# EAGLE schematic data_proV1.1 (EAGLE 7.6.0)
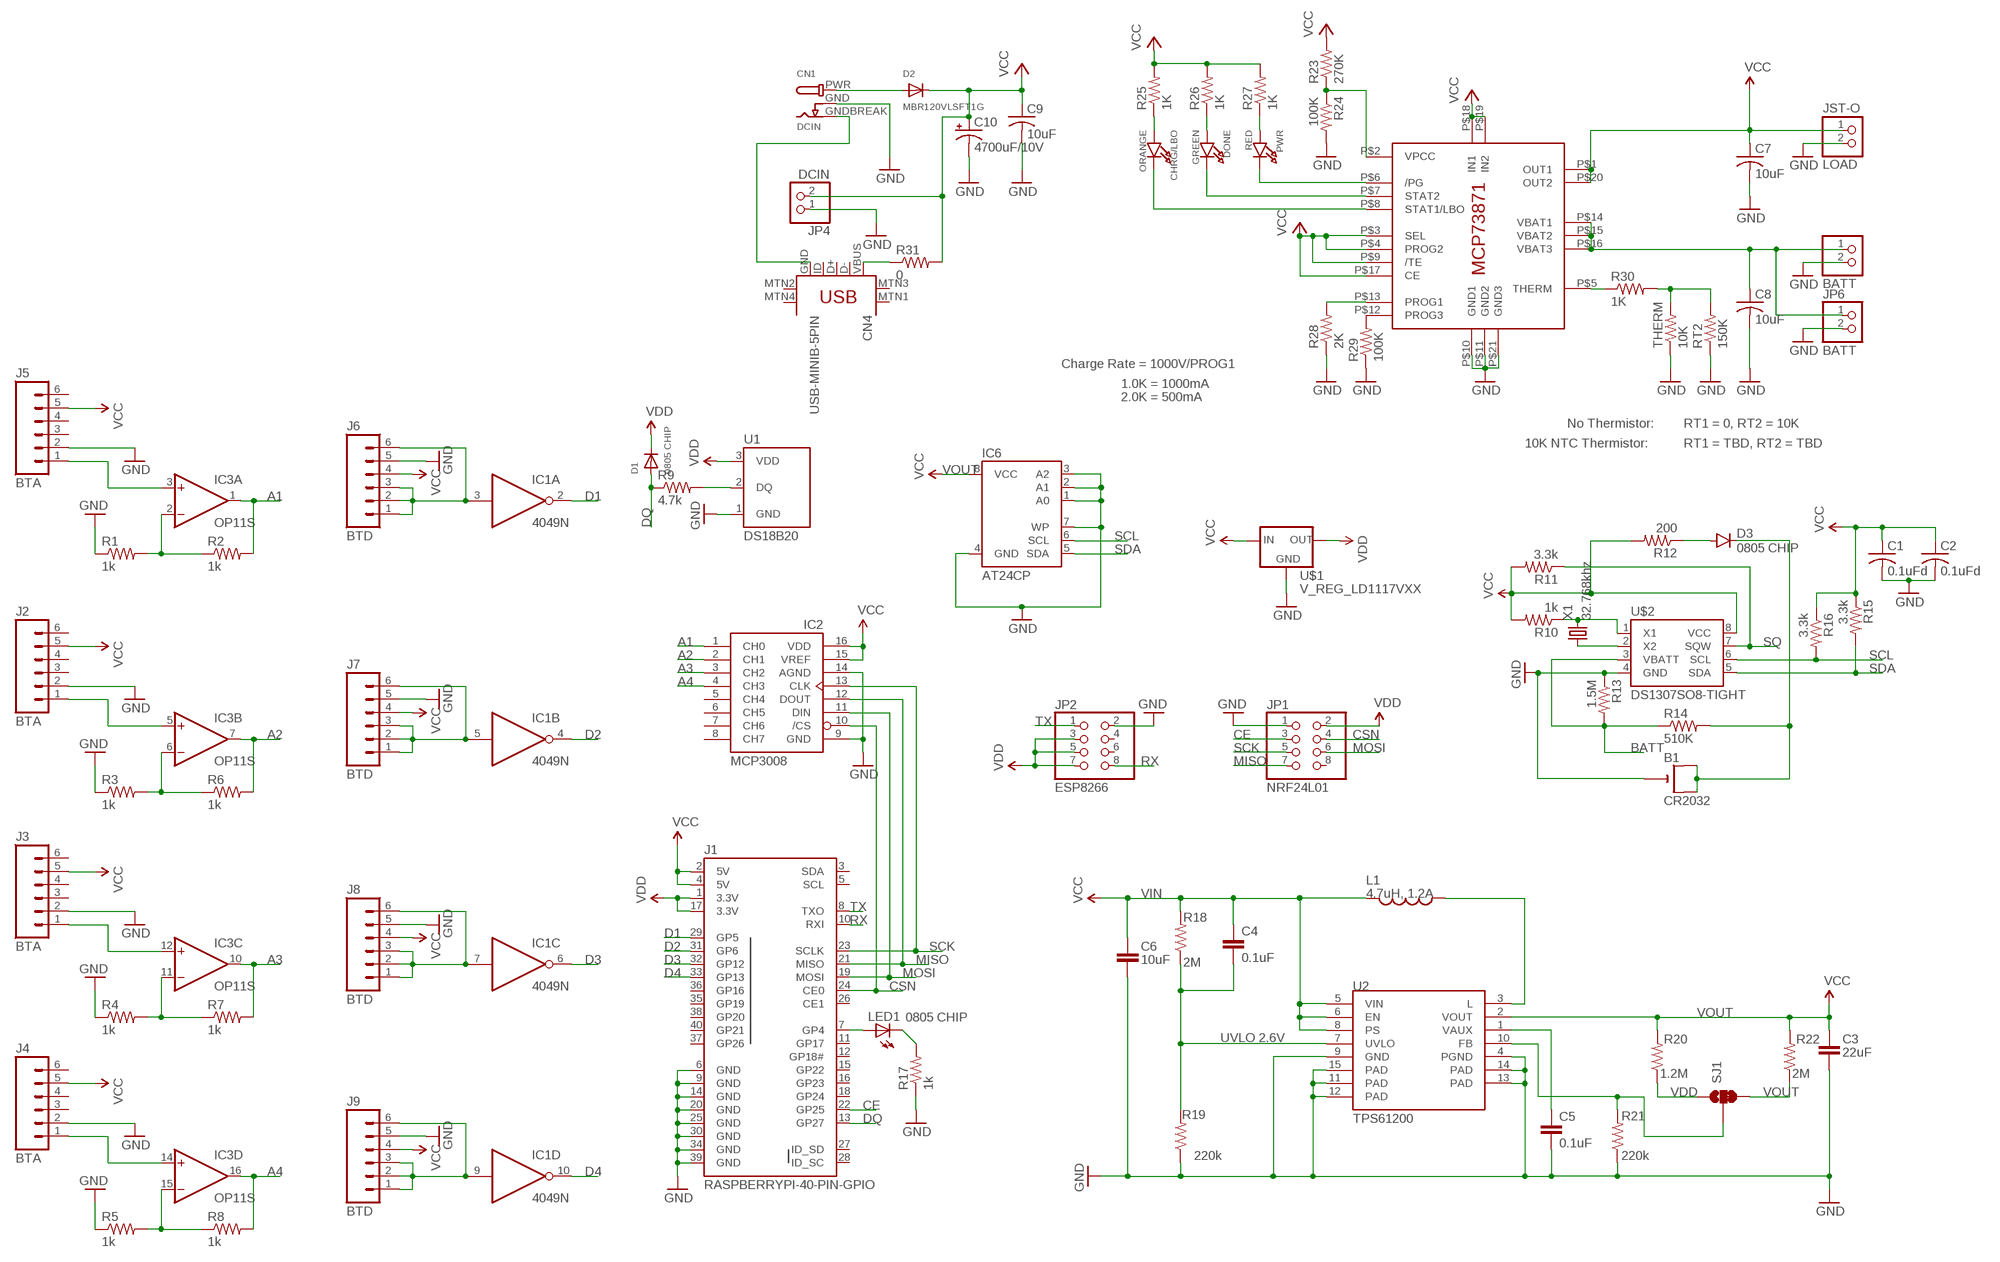
[diagram p0: schematic, sheet 1]

## Parts
B1  CR2032  CR2032SMT  [CR2032-SMD]
BATT  JST_2PIN-SMT-RA  [JST-PH-2-SMT-RA]
C1  0.1uFd  C-USC0805  [C0805]
C2  0.1uFd  C-USC0805  [C0805]
C3  22uF  CAP0805  [0805]
C4  0.1uF  CAP0603-CAP  [0603-CAP]
C5  0.1uF  CAP0603-CAP  [0603-CAP]
C6  10uF  CAP1206  [1206]
C7  10uF  C-USC0805K  [C0805K]
C8  10uF  C-USC0805K  [C0805K]
C9  10uF  C-USC0805K  [C0805K]
C10  4700uF/10V  CPOL-USE5-13  [E5-13]
CHRG/LBO  ORANGE  LED0805_NOOUTLINE  [CHIPLED_0805_NOOUTLINE]
CN1  DCIN  DCBARRELSMT  [DCJACK_2MM_SMT]
CN4  USB-MINIB-5PIN  [USB-MINIB]
D1  0805 CHIP  DIODESOD-323F  [SOD-323F]
D2  MBR120VLSFT1G  DIODESOD-123  [SOD-123]
D3  0805 CHIP  DIODESMB  [SMB-DIODE]
DONE  GREEN  LED0805_NOOUTLINE  [CHIPLED_0805_NOOUTLINE]
IC1  4049N  [DIL16]
IC2  MCP3008  [DIL16]
IC3  OP11S  [DIL16]
IC4  MCP73871  [QFN20_4MM]
IC6  AT24CP  [DIL08]
J1  RASPBERRYPI-40-PIN-GPIO  [2X20-SHROUDED]
J2  BTA  M06VERNIER-ANALOG  [BTA]
J3  BTA  M06VERNIER-ANALOG  [BTA]
J4  BTA  M06VERNIER-ANALOG  [BTA]
J5  BTA  M06VERNIER-ANALOG  [BTA]
J6  BTD  M06VERNIER-DIGITAL  [BTD]
J7  BTD  M06VERNIER-DIGITAL  [BTD]
J8  BTD  M06VERNIER-DIGITAL  [BTD]
J9  BTD  M06VERNIER-DIGITAL  [BTD]
JP1  NRF24L01  PINHD-2X4  [2X04]
JP2  ESP8266  PINHD-2X4  [2X04]
JP4  DCIN  HEADER-1X2  [1X02_OVAL]
JP6  BATT  HEADER-1X2ROUND  [1X02_ROUND]
L1  4.7uH, 1.2A  INDUCTOR.  [CDRH2D09]
LED1  0805 CHIP  LEDCHIP-LED0805  [CHIP-LED0805]
LOAD  JST-O  JST_2PIN-SMT-RA  [JST-PH-2-SMT-RA]
PWR  RED  LED0805_NOOUTLINE  [CHIPLED_0805_NOOUTLINE]
R1  1k  R-US_R0805  [R0805]
R2  1k  R-US_R0805  [R0805]
R3  1k  R-US_R0805  [R0805]
R4  1k  R-US_R0805  [R0805]
R5  1k  R-US_R0805  [R0805]
R6  1k  R-US_R0805  [R0805]
R7  1k  R-US_R0805  [R0805]
R8  1k  R-US_R0805  [R0805]
R9  4.7k  R-US_R0805  [R0805]
R10  1k  R-US_R0805  [R0805]
R11  3.3k  R-US_R0805  [R0805]
R12  200  R-US_R0805  [R0805]
R13  1.5M  R-US_R0805  [R0805]
R14  510K  R-US_R0805  [R0805]
R15  3.3k  R-US_R0805  [R0805]
R16  3.3k  R-US_R0805  [R0805]
R17  1k  R-US_R0805  [R0805]
R18  2M  RESISTOR0603-RES  [0603-RES]
R19  220k  RESISTOR0603-RES  [0603-RES]
R20  1.2M  RESISTOR0603-RES  [0603-RES]
R21  220k  RESISTOR0603-RES  [0603-RES]
R22  2M  RESISTOR0603-RES  [0603-RES]
R23  270K  R-US_R0805  [R0805]
R24  100K  R-US_R0805  [R0805]
R25  1K  R-US_R0805  [R0805]
R26  1K  R-US_R0805  [R0805]
R27  1K  R-US_R0805  [R0805]
R28  2K  R-US_FLIPFLOP  [0805-THM]
R29  100K  R-US_R0805  [R0805]
R30  1K  R-US_M0805  [M0805]
R31  0  R-US_R0805  [R0805]
RT2  150K  R-US_M0805  [M0805]
SJ1  SOLDERJUMPER_2WAYPASTE2&3  [SJ_3_PASTE2&3]
THERM  10K  R-US_FLIPFLOP  [0805-THM]
U1  DS18B20  [TO-92-AMMO]
U2  TPS61200  [QFN-10_PAD]
U$1  V_REG_LD1117VXX  [78XXL]
U$2  DS1307SO8-TIGHT  [SO08-TIGHT]
X1  32.768khz  CRYSTALTC38H  [TC38H]

## Nets
A1: IC2.1(CH0) IC3.1(A:OUT) R2.2
A2: IC2.2(CH1) IC3.7(B:OUT) R6.2
A3: IC2.3(CH2) IC3.10(C:OUT) R7.2
A4: IC2.4(CH3) IC3.16(D:OUT) R8.2
BATT: R13.2 R14.1 U$2.3(VBATT)
BATT1: BATT.1 C8.1 IC4.P$14(VBAT1) IC4.P$15(VBAT2) IC4.P$16(VBAT3) JP6.1
CE: J1.22(GP25) JP1.3
CSN: IC2.10(/CS) J1.24(CE0) JP1.4
D1: IC1.2(A:O) J1.29(GP5)
D2: IC1.4(B:O) J1.31(GP6)
D3: IC1.6(C:O) J1.32(GP12)
D4: IC1.10(D:O) J1.33(GP13)
DQ: D1.A J1.13(GP27) R9.1
FB: R21.2 SJ1.2 U2.10(FB)
GND: B1.- BATT.2 C1.2 C2.2 C3.2 C5.2 C6.2 C7.2 C8.2 C9.2 C10.- CN1.GND(GNDBREAK) IC2.9(GND) IC2.14(AGND) IC4.P$10(GND1) IC4.P$11(GND2) IC4.P$21(GND3) IC6.1(A0) IC6.2(A1) IC6.3(A2) IC6.4(GND) IC6.7(WP) J1.6(GND) J1.9(GND) J1.14(GND) J1.20(GND) J1.25(GND) J1.30(GND) J1.34(GND) J1.39(GND) J2.2 J3.2 J4.2 J5.2 J6.5 J7.5 J8.5 J9.5 JP1.1 JP2.2 JP4.1 JP6.2 LOAD.2 R1.1 R3.1 R4.1 R5.1 R13.1 R17.1 R19.1 R21.1 R24.2 R28.1 R29.1 RT2.1 THERM.1 U1.1(GND) U2.4(PGND) U2.9(GND) U2.11(PAD) U2.12(PAD) U2.13(PAD) U2.14(PAD) U2.15(PAD) U$1.IN(GND) U$2.4(GND)
MISO: IC2.12(DOUT) J1.21(MISO) JP1.7
MOSI: IC2.11(DIN) J1.19(MOSI) JP1.6
N$1: U$2.2(X2) X1.1
N$2: R10.1 U$2.1(X1) X1.2
N$3: B1.+$1(+) B1.+$2(+1) D3.C R14.2
N$4: J1.7(GP4) LED1.A
N$5: IC3.2(A:-IN) R1.2 R2.1
N$6: R9.2 U1.2(DQ)
N$7: IC3.15(D:-IN) R5.2 R8.1
N$8: IC3.6(B:-IN) R3.2 R6.1
N$9: L1.P$1 U2.3(L)
N$10: D3.A R12.1
N$11: IC1.3(A:I) J6.1 J6.2 J6.3 J6.6
N$12: IC1.5(B:I) J7.1 J7.2 J7.3 J7.6
N$13: C5.1 U2.1(VAUX)
N$14: IC1.7(C:I) J8.1 J8.2 J8.3 J8.6
N$15: IC1.9(D:I) J9.1 J9.2 J9.3 J9.6
N$16: IC3.11(C:-IN) R4.2 R7.1
N$17: LED1.C R17.2
N$18: IC4.P$2(VPCC) R23.1 R24.1
N$19: IC4.P$6(/PG) PWR.C
N$20: DONE.C IC4.P$7(STAT2)
N$21: CHRG/LBO.C IC4.P$8(STAT1/LBO)
N$22: CHRG/LBO.A R25.1
N$23: DONE.A R26.1
N$24: PWR.A R27.1
N$25: IC4.P$12(PROG3) R29.2
N$26: IC4.P$13(PROG1) R28.2
N$27: IC4.P$5(THERM) R30.1
N$28: R30.2 RT2.2 THERM.2
N$29: CN1.PWR D2.A
N$30: CN4.VBUS R31.1
N$31: CN1.GNDBREAK(GND) CN4.GND
RX: J1.10(RXI) JP2.8
S1-5V1: IC3.5(B:+IN) J2.1
S1-5V2: IC3.12(C:+IN) J3.1
S1-5V3: IC3.3(A:+IN) J5.1
S1-5V4: IC3.14(D:+IN) J4.1
SCK: IC2.13(CLK) J1.23(SCLK) JP1.5
SCL: IC6.6(SCL) R16.2 U$2.6(SCL)
SDA: IC6.5(SDA) R15.2 U$2.5(SDA)
SQ: R11.1 U$2.7(SQW)
TX: J1.8(TXO) JP2.1
UVLO: C4.2 R18.1 R19.2 U2.7(UVLO)
VDD: D1.C J1.1(3.3V) J1.17(3.3V) JP1.2 JP2.3 JP2.5 JP2.7 R20.1 SJ1.1 U1.3(VDD) U$1.GND(OUT)
VIN: C4.1 C6.1 C7.1 IC4.P$1(OUT1) IC4.P$20(OUT2) L1.P$2 LOAD.1 R18.2 U2.5(VIN) U2.6(EN) U2.8(PS) ; supply symbol labelled VCC
VOUT: C1.1 C2.1 C3.1 C9.1 C10.+ D2.C IC2.15(VREF) IC2.16(VDD) IC4.P$3(SEL) IC4.P$4(PROG2) IC4.P$9(/TE) IC4.P$17(CE) IC4.P$18(IN1) IC4.P$19(IN2) IC6.8(VCC) J1.2(5V) J1.4(5V) J2.5 J3.5 J4.5 J5.5 J6.4 J7.4 J8.4 J9.4 JP4.2 R10.2 R11.2 R12.2 R15.1 R16.1 R20.2 R22.1 R22.2 R23.2 R25.2 R26.2 R27.2 R31.2 SJ1.3 U2.2(VOUT) U$1.OUT(IN) U$2.8(VCC) ; supply symbol labelled VCC
Unconnected: CN4.D+ CN4.D- CN4.ID CN4.MTN1(MTN2) CN4.MTN2(MTN3) CN4.MTN3(MTN1) CN4.MTN4 IC1.11(E:I) IC1.12(E:O) IC1.14(F:I) IC1.15(F:O) IC2.5(CH4) IC2.6(CH5) IC2.7(CH6) IC2.8(CH7) J1.3(SDA) J1.5(SCL) J1.11(GP17) J1.12(GP18#) J1.15(GP22) J1.16(GP23) J1.18(GP24) J1.26(CE1) J1.27(ID_SD) J1.28(ID_SC) J1.35(GP19) J1.36(GP16) J1.37(GP26) J1.38(GP20) J1.40(GP21) J2.3 J2.4 J2.6 J3.3 J3.4 J3.6 J4.3 J4.4 J4.6 J5.3 J5.4 J5.6 JP1.8 JP2.4 JP2.6

## Notes on the sheet
- Charge Rate = 1000V/PROG1
- 1.0K = 1000mA
- 2.0K = 500mA
- No Thermistor: | RT1 = 0, RT2 = 10K
- 10K NTC Thermistor: | RT1 = TBD, RT2 = TBD
- UVLO 2.6V

## Power pins joined to a net without a drawn wire
V+: IC3.4(P:V+)
V-: IC3.13(P:V-)
VDD: IC1.1(P:VDD)
VSS: IC1.8(P:VSS)

## Library data of the parts
B1 = adafruit:CR2032
BATT LOAD = adafruit:JST_2PIN: JST 2-Pin Connectors of various flavors SMT-RA (S2B-PH-SM4) 4UConnector #17311 SMT (B2B-PH-SM4) THM-RA (S2B-PH) THM (B2B-PH)
C1 C2 = resistor:C-US: CAPACITOR, American symbol
C3 C6 = CH_passive:CAP: Capacitor Standard 0603 ceramic capacitor, and 0.1" leaded capacitor.
C4 C5 = SparkFun:CAP: Capacitor Standard 0603 ceramic capacitor, and 0.1" leaded capacitor.
C7-C9 = adafruit:C-US: CAPACITOR, American symbol
C10 = adafruit:CPOL-US: POLARIZED CAPACITOR, American symbol
CHRG/LBO DONE PWR = microbuilder:LED: LED
CN1 = microbuilder:DCBARREL: DC Barrel Jack DCJACK_1.3MM_PTH - Through Hole 1.3mm Jack (4UConnector: 05536) DCJACK_2MM_PTH - Through Hole 2.0/2.1 Jack (4UConnector: 05537) DCJACK_2MM_SMT - SMT 2.0/2.1mm Jack(4UConnector: 03267)
CN4 = SparkFun-Connectors:USB-MINIB: Mini-USB "B" connector with 5th pin broken out. Created new symbol breaking out 5th "ID" pin in mini/micro USB connector spec. See: http://en.wikipedia.org/wiki/Mini_usb#Cables. Uses same footprint as 4-pin symbol. Also added pins to connect to mounting / shield pads if required (probably not generally needed as signals aren't shielded once they leave the connector).; PROD_ID: CONN-08193
D1 = adafruit:DIODE: Diode
D2 = microbuilder:DIODE: Diode
D3 = SparkFun-DiscreteSemi:DIODE: Diode; PROD_ID: DIO-09646
IC1 = 40xx:4049: Hex inverting BUFFER
IC2 = adafruit:MCP3008
IC3 = linear:OP11: Quad Low-Offset Low-Power OP AMP The OP-11 is pin compatible with the OP-400 , LM148, HA4741, RM4156, and LT1014 operational amplifiers source http://products.analog.com/products/info.asp?product=OP400
IC4 = adafruit:MCP73871
IC6 = atmel:AT24C*: 2-wire serial EEPROM; MPN: AT24C1024BW-SH-B; OC_FARNELL: 1362646; OC_NEWARK: 03P2044
J1 = SparkFun-Boards:RASPBERRYPI-40-PIN-GPIO: Second Generation Raspberry Pi GPIO Header 2x20 pin connector, as found on B, B+, A+ models.
J2-J9 = SparkFun-Connectors:M06: Header 6 Standard 6-pin 0.1" header. Use with straight break away headers (SKU : PRT-00116), right angle break away headers (PRT-00553), swiss pins (PRT-00743), machine pins (PRT-00117), and female headers (PRT-00115). Molex polarized connector foot print use with SKU : PRT-08094 with associated crimp pins and housings. NOTES ON THE VARIANTS LOCK and LOCK_LONGPADS... This footprint was designed to help hold the alignment of a through-hole component (i.e. 6-pin header) while soldering it into place. You may notice that each hole has been shifted either up or down by 0.005 of an inch from it's more standard position (which is a perfectly straight line). This slight alteration caused the pins (the squares in the middle) to touch the edges of the holes. Because they are alternating, it causes a "brace" to hold the component in place. 0.005 has proven to be the perfect amount of "off-center" position when using our standard breakaway headers. Although looks a little odd when you look at the bare footprint, once you have a header in there, the alteration is very hard to notice. Also,if you push a header all the way into place, it is covered up entirely on the bottom side. This idea of altering the position of holes to aid alignment will be further integrated into the Sparkfun Library for other footprints. It can help hold any component with 3 or more connection pins.
JP1 = pinhead:PINHD-2X4: PIN HEADER
JP2 = adafruit:PINHD-2X4: PIN HEADER
JP4 JP6 = microbuilder:HEADER-1X2: PIN HEADER
L1 = SparkFun:INDUCTOR: Inductors Basic Inductor/Choke - 0603 and 1206. Footprints are not proven and vary greatly between part numbers.
LED1 = led:LED: LED
R1-R9 = resistor:R-US_: RESISTOR, American symbol
R10-R17 R23-R31 RT2 THERM = adafruit:R-US_: RESISTOR, American symbol
R18-R22 = SparkFun:RESISTOR: Resistor Basic schematic elements and footprints for 0603, 1206, and PTH resistors.
SJ1 = SparkFun:SOLDERJUMPER_2WAY: Solder Jumper 2 way solder jumper
U1 = SparkFun-Sensors:DS18B20: Dallas/Maxim DS18B20 1-wire temperature sensor Datasheet: http://datasheets.maximintegrated.com/en/ds/DS18B20.pdf temp thermometer 1-wire one-wire one wire; STORE_ID: SEN-00245
U2 = SparkFun:TPS61200: DC to DC Booster
U$1 = SparkFun-PowerIC:V_REG_LD1117VXX: LD1117VXX voltage regulator. We carry the 3.3V version (COM-00526) in TO-220 package.
U$2 = SparkFun-FreqCtrl:DS1307: I2C real-time clock with battery backup.; PROD_ID: IC-08138
X1 = crystal:CRYSTAL: CRYSTAL; OC_FARNELL: unknown; OC_NEWARK: unknown